# EAGLE design ui_swithes (EAGLE 5.11)
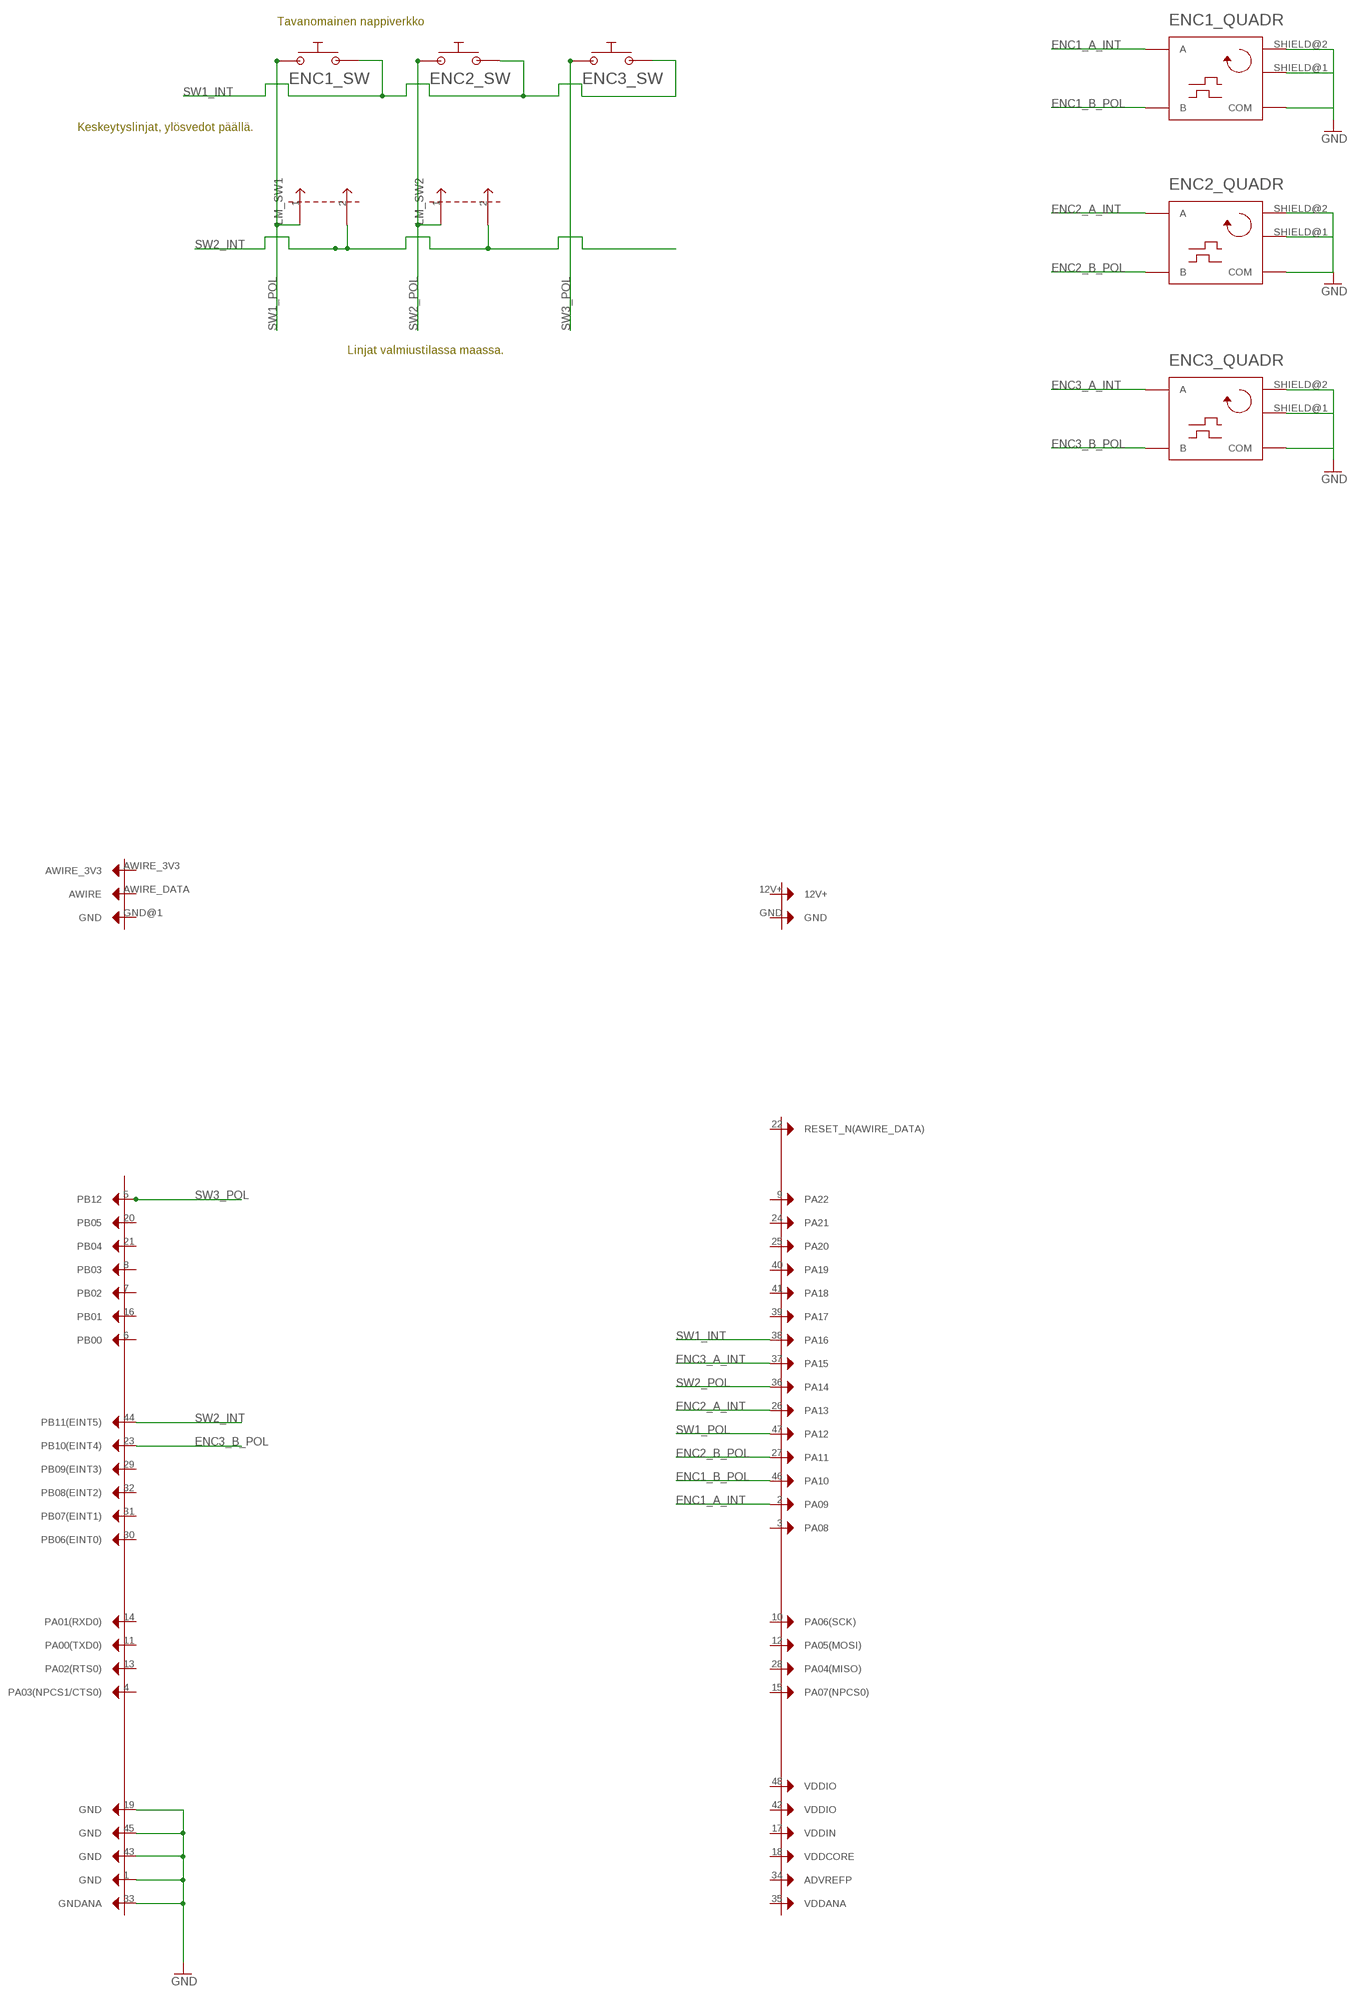
[diagram p0: schematic, sheet 1, part 1 of 2]
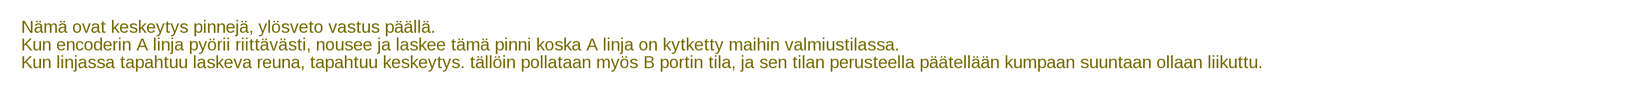
[diagram p1: schematic, sheet 1, part 2 of 2]

## Parts
CON1  IO_BOARD_CONNECTORUUSI  [AT32UCL_IO_BOARD_CONNECTOR_V2]
ENC1  ENCODER_QUADRATE_WITH_BUTTON  [ENCODER_PEC11-4XXXF-SXXXX]
ENC2  ENCODER_QUADRATE_WITH_BUTTON  [ENCODER_PEC11-4XXXF-SXXXX]
ENC3  ENCODER_QUADRATE_WITH_BUTTON  [ENCODER_PEC11-4XXXF-SXXXX]
LM_SW1  CONNECTOR_2PIN1X2  [1X2_GENERIC]
LM_SW2  CONNECTOR_2PIN1X2  [1X2_GENERIC]

## Nets
ENC1_A_INT: CON1.2(PA09) ENC1.A(_QUADR:A)
ENC1_B_POL: CON1.46(PA10) ENC1.B(_QUADR:B)
ENC2_A_INT: CON1.26(PA13) ENC2.A(_QUADR:A)
ENC2_B_POL: CON1.27(PA11) ENC2.B(_QUADR:B)
ENC3_A_INT: CON1.37(PA15) ENC3.A(_QUADR:A)
ENC3_B_POL: CON1.23(PB10(EINT4)) ENC3.B(_QUADR:B)
GND: CON1.1(GND) CON1.19(GND) CON1.33(GNDANA) CON1.43(GND) CON1.45(GND) ENC1.COMMON(_QUADR:COM) ENC1.SHIELD@1(_QUADR:SHIELD) ENC1.SHIELD@2(_QUADR:SHIELD) ENC2.COMMON(_QUADR:COM) ENC2.SHIELD@1(_QUADR:SHIELD) ENC2.SHIELD@2(_QUADR:SHIELD) ENC3.COMMON(_QUADR:COM) ENC3.SHIELD@1(_QUADR:SHIELD) ENC3.SHIELD@2(_QUADR:SHIELD)
SW1_INT: CON1.38(PA16) ENC1.SW2 ENC2.SW2 ENC3.SW2
SW1_POL: CON1.47(PA12) ENC1.SW1 LM_SW1.1
SW2_INT: CON1.44(PB11(EINT5)) LM_SW1.2 LM_SW2.2
SW2_POL: CON1.36(PA14) ENC2.SW1 LM_SW2.1
SW3_POL: CON1.5(PB12) ENC3.SW1
Unconnected: CON1.3(PA08) CON1.4(PA03(NPCS1/CTS0)) CON1.6(PB00) CON1.7(PB02) CON1.8(PB03) CON1.9(PA22) CON1.10(PA06(SCK)) CON1.11(PA00(TXD0)) CON1.12(PA05(MOSI)) CON1.12V+ CON1.13(PA02(RTS0)) CON1.14(PA01(RXD0)) CON1.15(PA07(NPCS0)) CON1.16(PB01) CON1.17(VDDIN) CON1.18(VDDCORE) CON1.20(PB05) CON1.21(PB04) CON1.22(RESET_N(AWIRE_DATA)) CON1.24(PA21) CON1.25(PA20) CON1.28(PA04(MISO)) CON1.29(PB09(EINT3)) CON1.30(PB06(EINT0)) CON1.31(PB07(EINT1)) CON1.32(PB08(EINT2)) CON1.34(ADVREFP) CON1.35(VDDANA) CON1.39(PA17) CON1.40(PA19) CON1.41(PA18) CON1.42(VDDIO) CON1.48(VDDIO) CON1.AWIRE_3V3 CON1.AWIRE_DATA(AWIRE) CON1.GND CON1.GND@1(GND)

## Notes on the sheet
- Tavanomainen nappiverkko
- Keskeytyslinjat, ylösvedot päällä.
- Nämä ovat keskeytys pinnejä, ylösveto vastus päällä.
- Kun encoderin A linja pyörii riittävästi, nousee ja laskee tämä pinni koska A linja on kytketty maihin valmiustilassa.
- Kun linjassa tapahtuu laskeva reuna, tapahtuu keskeytys. tällöin pollataan myös B portin tila, ja sen tilan perusteella päätellään kumpaan suuntaan ollaan liikuttu.
- Linjat valmiustilassa maassa.

## Library data of the parts
CON1 = timelapse-prototype-parts:IO_BOARD_CONNECTOR
ENC1-ENC3 = timelapse-prototype-parts:ENCODER_QUADRATE_WITH_BUTTON
LM_SW1 LM_SW2 = connectors:CONNECTOR_2PIN

## Board
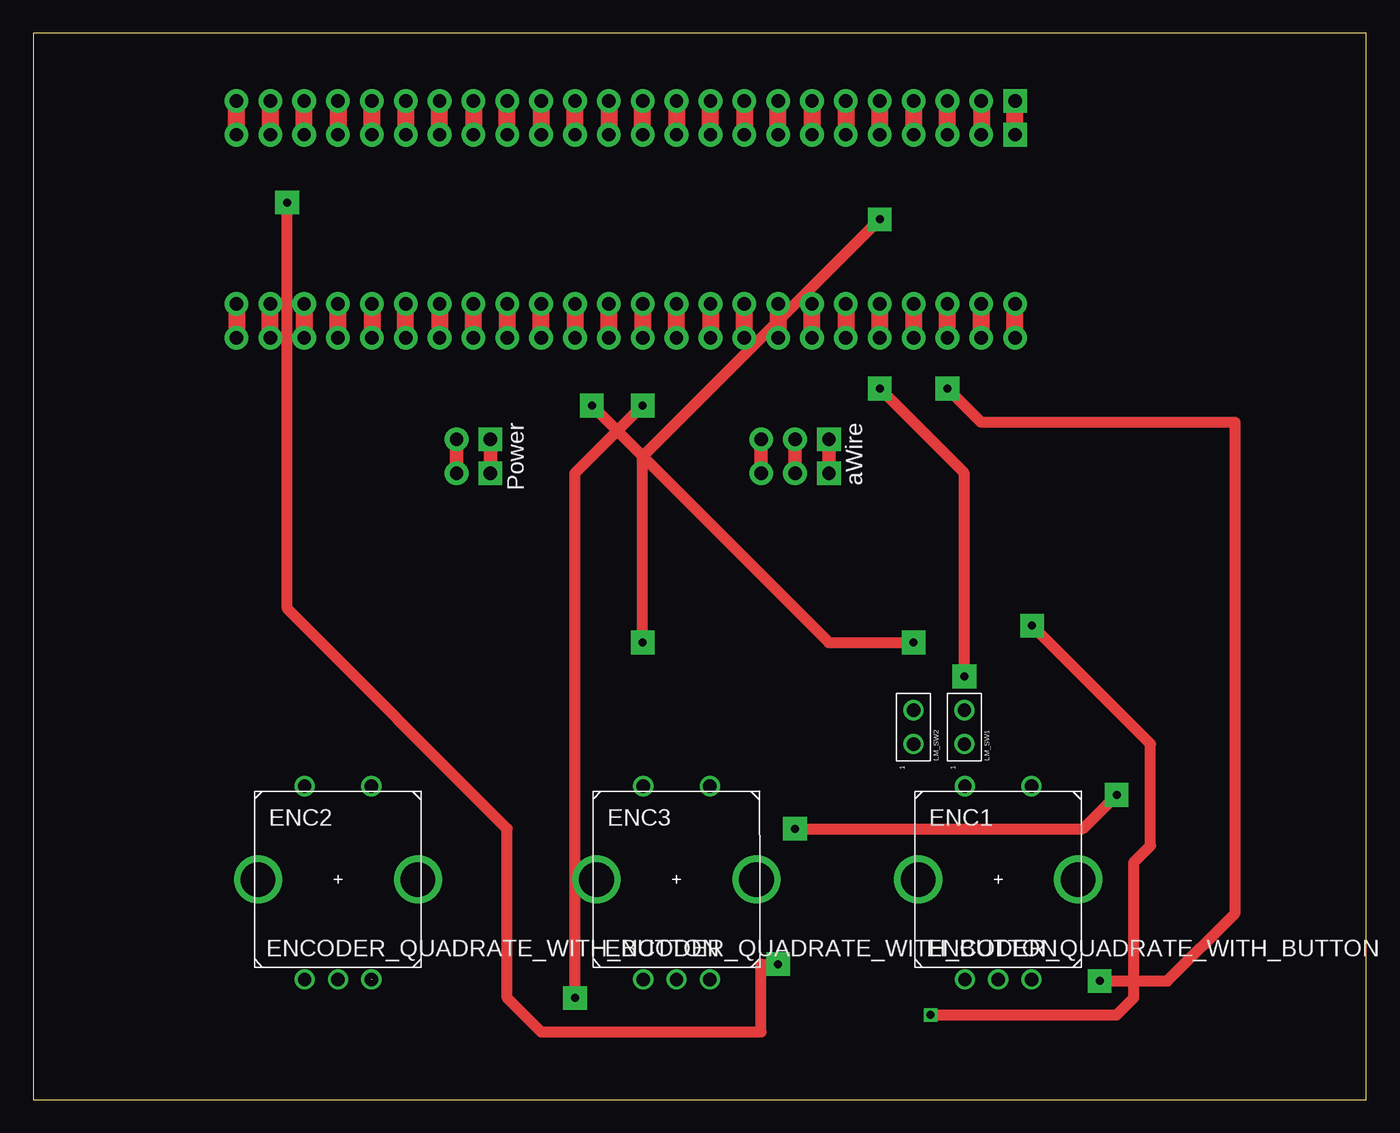
[diagram p2: board, top side]
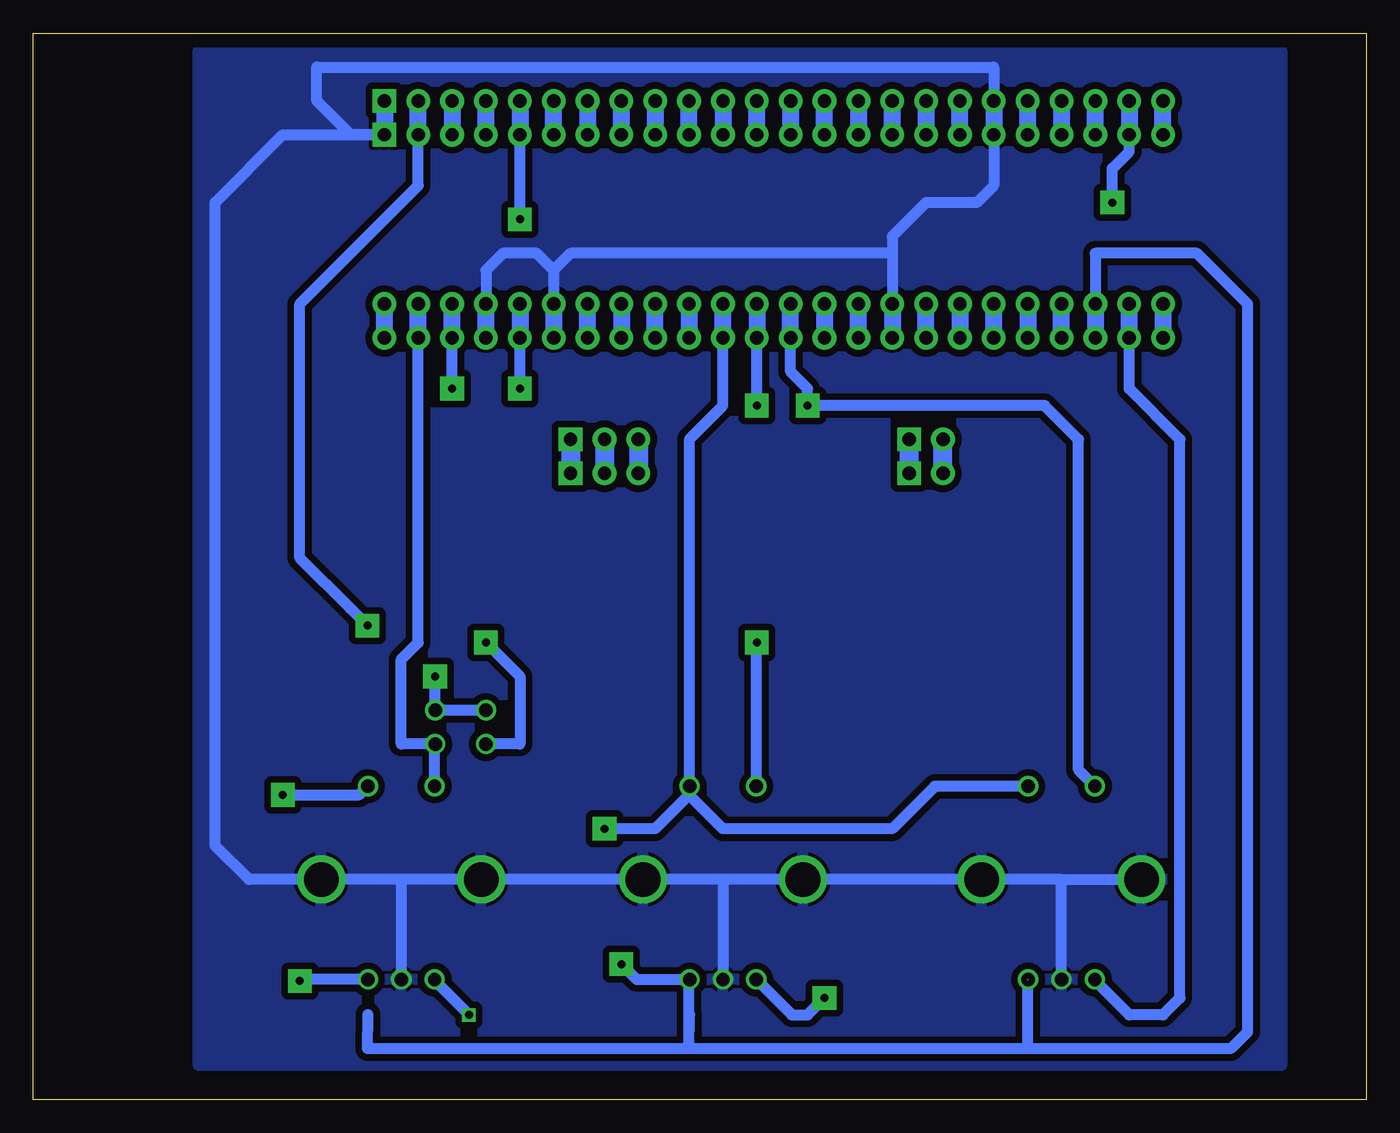
[diagram p3: board, bottom side, seen from below]

Size 100 x 80 mm. Coordinates in mm from the lower left corner, seen from the top.
Outline: 0,0 100,0 100,80 0,80 0,0
Copper layers (1*16): Top 0.035mm / dielectric 1.5mm / Bottom 0.035mm
Design rules "default *": minimum track width 10mil, minimum drill 24mil, track to track 20mil, track to pad 20mil, pad to pad 8mil, via to via 8mil, smd to smd 8mil, copper to edge 40mil, drill to drill 8mil, minimum pad ring 10mil, minimum via ring 8mil, stop-mask expansion 4mil, vias tented up to drill 0mil, thermal gap 10mil

### Footprints (pad centres in the part's own frame; a part is rotated, then mirrored left to right if it is on the bottom)
AT32UCL_IO_BOARD_CONNECTOR_V2 = drill 1 pad 1.778 square: 1 -15.24,-19.05; 12V+ 24.13,3.81; AWIRE_DATA -1.27,3.81; NC1 -15.24,-21.59; P$100 -1.27,6.35; P$104 24.13,6.35 | drill 1 pad 1.778 round: 2 -12.7,-19.05; 3 -10.16,-19.05; 4 -7.62,-19.05; 5 -5.08,-19.05; 6 -2.54,-19.05; 7 0,-19.05; 8 2.54,-19.05; 9 5.08,-19.05; 10 7.62,-19.05; 11 10.16,-19.05; 12 12.7,-19.05; 13 15.24,-19.05; 14 17.78,-19.05; 15 20.32,-19.05; 16 22.86,-19.05; 17 25.4,-19.05; 18 27.94,-19.05; 19 30.48,-19.05; 20 33.02,-19.05; 21 35.56,-19.05; 22 38.1,-19.05; 23 40.64,-19.05; 24 43.18,-19.05; 25 43.18,-3.81; 26 40.64,-3.81; 27 38.1,-3.81; 28 35.56,-3.81; 29 33.02,-3.81; 30 30.48,-3.81; 31 27.94,-3.81; 32 25.4,-3.81; 33 22.86,-3.81; 34 20.32,-3.81; 35 17.78,-3.81; 36 15.24,-3.81; 37 12.7,-3.81; 38 10.16,-3.81; 39 7.62,-3.81; 40 5.08,-3.81; 41 2.54,-3.81; 42 0,-3.81; 43 -2.54,-3.81; 44 -5.08,-3.81; 45 -7.62,-3.81; 46 -10.16,-3.81; 47 -12.7,-3.81; 48 -15.24,-3.81; 49 43.18,-6.35; 50 40.64,-6.35; 51 38.1,-6.35; 52 35.56,-6.35; 53 33.02,-6.35; 54 30.48,-6.35; 55 27.94,-6.35; 56 25.4,-6.35; 57 22.86,-6.35; 58 20.32,-6.35; 59 17.78,-6.35; 60 15.24,-6.35; 61 12.7,-6.35; 62 10.16,-6.35; 63 7.62,-6.35; 64 5.08,-6.35; 65 2.54,-6.35; 66 0,-6.35; 67 -2.54,-6.35; 68 -5.08,-6.35; 69 -7.62,-6.35; 70 -10.16,-6.35; 71 -12.7,-6.35; 72 -15.24,-6.35; AWIRE_3V3 3.81,3.81; GND 1.27,3.81; GND@1 26.67,3.81; NC2 -12.7,-21.59; NC3 -10.16,-21.59; NC4 -7.62,-21.59; NC5 -5.08,-21.59; NC6 -2.54,-21.59; NC7 0,-21.59; NC8 2.54,-21.59; NC9 5.08,-21.59; NC10 7.62,-21.59; NC11 10.16,-21.59; NC12 12.7,-21.59; NC13 15.24,-21.59; NC14 17.78,-21.59; NC15 20.32,-21.59; NC16 22.86,-21.59; NC17 25.4,-21.59; NC18 27.94,-21.59; NC19 30.48,-21.59; NC20 33.02,-21.59; NC21 35.56,-21.59; NC22 38.1,-21.59; NC23 40.64,-21.59; NC24 43.18,-21.59; P$1 3.81,6.35; P$99 1.27,6.35; P$103 26.67,6.35
ENCODER_PEC11-4XXXF-SXXXX = drill 1 round: A -2.5,-7.5; B 2.5,-7.5; COMMON 0,-7.5; SW1 -2.5,7; SW2 2.5,7 | drill 2.6 round: SHIELD@1 -6,0; SHIELD@2 6,0
1X2_GENERIC = drill 1 round: 1 0,0; 2 2.54,0

### Placement (x,y rotation side)
CON1  58.42,53.34 180 top
ENC1  72.39,16.51 0 top
ENC2  22.86,16.51 0 top
ENC3  48.26,16.51 0 top
LM_SW1  69.85,26.67 90 top
LM_SW2  66.04,26.67 90 top

### Tracks (layer width: path | path; a pad name or v marks a point on that pad's centre or on a via)
ENC1_A_INT  (via drill 0.6, 0.6 pad 1.78)
  Top 0.813: v67.31,6.35 81.28,6.35 82.55,7.62 82.55,17.78 83.82,19.05 83.82,26.67 v74.93,35.56
  Bottom 0.813: CON1.2 71.12,68.58 80.01,59.69 80.01,40.64 76.2,36.83 v74.93,35.56 | ENC1.A 69.89,8.93 v67.31,6.35
ENC1_B_POL  (via drill 0.6 pad 1.78)
  Top 0.813: v80.01,8.89 85.09,8.89 90.17,13.97 90.17,50.8 71.12,50.8 v68.58,53.34
  Bottom 0.813: ENC1.B 79.89,9.01 v80.01,8.89 | v68.58,53.34 CON1.46
ENC2_A_INT
  Bottom 0.813: CON1.26 17.78,53.34 13.97,49.53 13.97,7.62 15.24,6.35 17.78,6.35 20.32,8.89 20.32,8.97 ENC2.A
ENC2_B_POL  (1 unrouted)
  Bottom 0.813: 74.89,6.39 74.93,3.81 50.8,3.81 | 50.8,3.81 50.8,8.97 | 50.8,3.81 50.76,6.39 | 25.4,3.81 50.8,3.81 | 25.4,3.81 25.4,8.97 | 25.4,3.81 25.36,3.85 | 25.4,3.81 10.16,3.81 8.89,5.08 8.89,59.69 12.7,63.5 20.32,63.5 CON1.27
ENC3_A_INT  (via drill 0.6 pad 1.78)
  Top 0.813: v40.64,7.62 40.64,46.99 v45.72,52.07
  Bottom 0.813: v40.64,7.62 41.91,6.35 43.1,6.35 ENC3.A | v45.72,52.07 CON1.37
ENC3_B_POL  (via drill 0.6 pad 1.78)
  Top 0.813: v55.88,10.16 54.61,10.16 54.61,5.08 38.1,5.08 35.56,7.62 35.56,20.32 19.05,36.83 v19.05,67.31
  Bottom 0.813: ENC3.B 54.73,9.01 v55.88,10.16 | v19.05,67.31 19.05,69.85 17.78,71.12 CON1.23 17.78,74.93
GND
  Bottom 0.813: 35.56,63.5 35.56,64.77 33.02,67.31 29.21,67.31 27.94,68.58 CON1.19 27.94,77.47 78.74,77.47 78.74,74.93 76.2,72.39 CON1.1 81.28,72.39 86.36,67.31 86.36,19.05 83.82,16.51 ENC1.SHIELD@2 72.39,16.51 | 35.56,63.5 CON1.33 | 35.56,63.5 59.69,63.5 60.96,62.23 | 60.96,62.23 CON1.43 | 60.96,62.23 62.23,63.5 64.77,63.5 66.04,62.23 CON1.45 | 22.86,16.51 ENC2.SHIELD@1 | 48.26,16.51 ENC3.SHIELD@1 ENC2.SHIELD@2 22.86,16.51 | 48.26,16.51 ENC3.SHIELD@2 ENC1.SHIELD@1 72.39,16.51 | 48.26,16.51 ENC3.COMMON | ENC2.COMMON 22.86,16.51 | 72.39,16.51 ENC1.COMMON
  pour Bottom: 7.62,78.74 6.35,78.74 6.35,2.54 87.63,2.54 87.63,78.74
SW1_INT  (via drill 0.6 pad 1.78)
  Top 0.813: v57.15,20.32 78.74,20.32 v81.28,22.86
  Bottom 0.813: ENC2.SW2 32.37,23.51 35.56,20.32 48.26,20.32 50.8,22.86 50.8,23.47 ENC3.SW2 | ENC3.SW2 50.76,22.9 53.34,20.32 v57.15,20.32 | v81.28,22.86 75.54,22.86 ENC1.SW2 | ENC3.SW2 50.76,49.57 48.26,52.07 CON1.38
SW1_POL
  Bottom 0.813: ENC1.SW1 69.89,26.63 LM_SW1.1 72.39,26.67 72.39,33.02 71.12,34.29 CON1.47
SW2_INT  (via drill 0.6 pad 1.78)
  Top 0.813: v69.85,31.75 69.85,46.99 v63.5,53.34
  Bottom 0.813: v69.85,31.75 LM_SW1.2 LM_SW2.2 | v63.5,53.34 CON1.44
SW2_POL  (via drill 0.6 pad 1.78)
  Top 0.813: v66.04,34.29 59.69,34.29 v41.91,52.07
  Bottom 0.813: LM_SW2.1 63.5,26.67 63.5,31.75 v66.04,34.29 | CON1.36 43.18,54.61 41.91,53.34 v41.91,52.07 24.13,52.07 21.59,49.53 21.59,24.74 ENC2.SW1
SW3_POL  (via drill 0.6 pad 1.78)
  Top 0.813: v45.72,34.29 45.72,48.26 v63.5,66.04
  Bottom 0.813: ENC3.SW1 45.76,34.25 v45.72,34.29 | v63.5,66.04 CON1.5